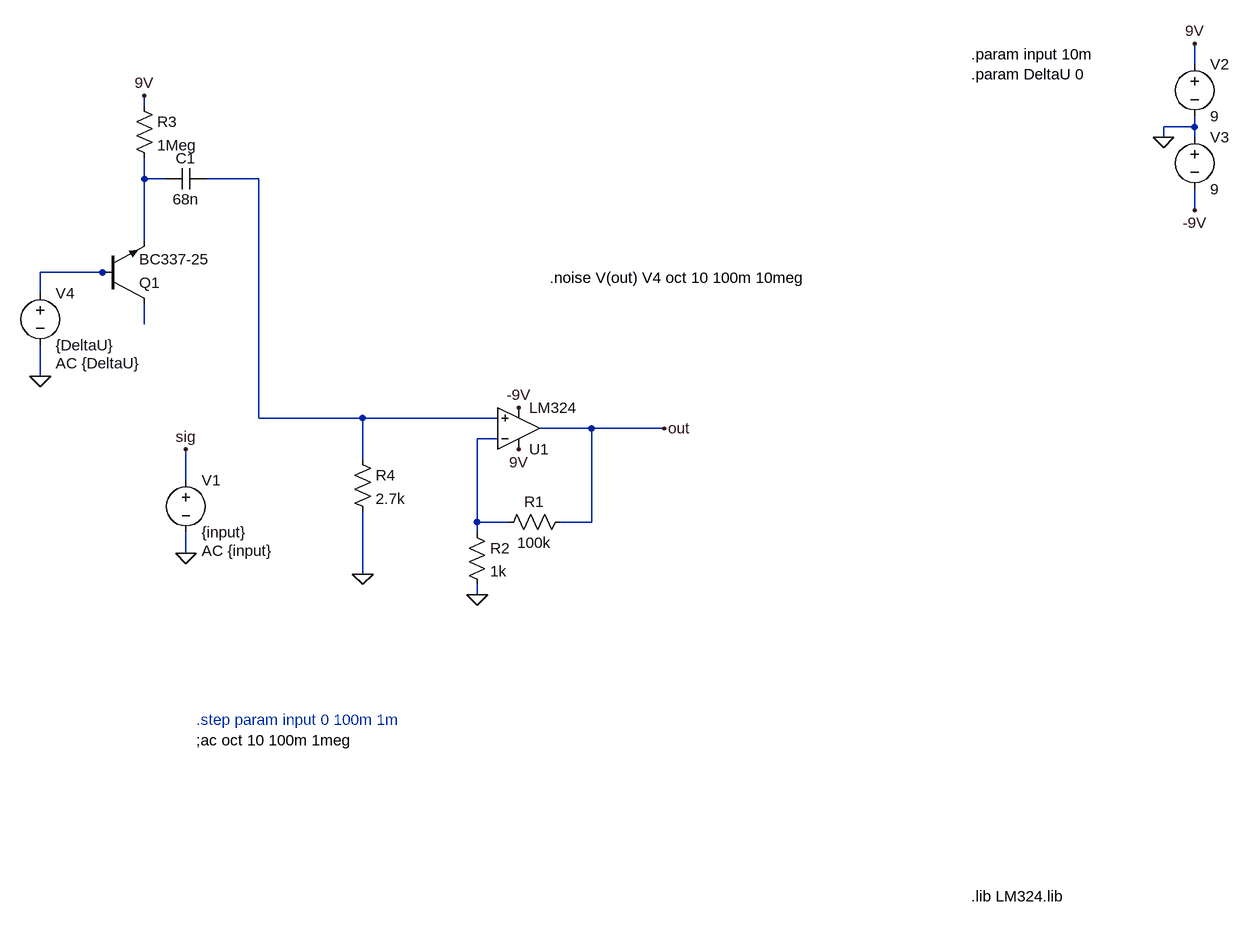
[diagram p0: schematic MessverstaerkerLab10_Shrotrauschen.asc]
MessverstaerkerLab10_Shrotrauschen.asc, the LTspice schematic file:
Version 4
SHEET 1 2032 772
WIRE 1504 -544 1504 -576
WIRE -112 -480 -112 -496
WIRE 1504 -448 1504 -464
WIRE 1504 -448 1456 -448
WIRE 1456 -432 1456 -448
WIRE 1504 -432 1504 -448
WIRE -112 -368 -112 -400
WIRE -80 -368 -112 -368
WIRE 64 -368 -16 -368
WIRE 1504 -320 1504 -352
WIRE -112 -272 -112 -368
WIRE -176 -224 -272 -224
WIRE -160 -224 -176 -224
WIRE -272 -192 -272 -224
WIRE -112 -144 -112 -176
WIRE -272 -64 -272 -112
WIRE 64 0 64 -368
WIRE 224 0 64 0
WIRE 432 0 224 0
WIRE 576 16 496 16
WIRE 688 16 576 16
WIRE 432 32 400 32
WIRE 224 64 224 0
WIRE -48 96 -48 48
WIRE 400 160 400 32
WIRE 448 160 400 160
WIRE 576 160 576 16
WIRE 576 160 528 160
WIRE 400 176 400 160
WIRE -48 208 -48 176
WIRE 224 240 224 144
WIRE 400 272 400 256
FLAG 1456 -432 0
FLAG 1504 -320 -9V
FLAG 1504 -576 9V
FLAG -48 208 0
FLAG -48 48 sig
FLAG 400 272 0
FLAG 688 16 out
FLAG 464 48 9V
FLAG 464 -16 -9V
FLAG -272 -64 0
FLAG -112 -496 9V
FLAG 224 240 0
SYMBOL voltage -48 80 R0
WINDOW 123 24 124 Left 2
WINDOW 39 24 124 Left 2
SYMATTR Value2 AC {input}
SYMATTR InstName V1
SYMATTR Value {input}
SYMBOL voltage 1504 -560 R0
WINDOW 123 0 0 Left 0
WINDOW 39 0 0 Left 0
SYMATTR InstName V2
SYMATTR Value 9
SYMBOL voltage 1504 -448 R0
WINDOW 123 0 0 Left 0
WINDOW 39 0 0 Left 0
SYMATTR InstName V3
SYMATTR Value 9
SYMBOL OpAmps\\opamp2 464 80 M180
SYMATTR InstName U1
SYMATTR Value LM324
SYMBOL res 544 144 R90
WINDOW 0 0 56 VBottom 2
WINDOW 3 32 56 VTop 2
SYMATTR InstName R1
SYMATTR Value 100k
SYMBOL res 384 160 R0
SYMATTR InstName R2
SYMATTR Value 1k
SYMBOL voltage -272 -208 R0
WINDOW 123 24 124 Left 2
WINDOW 39 0 0 Left 0
SYMATTR Value2 AC {DeltaU}
SYMATTR InstName V4
SYMATTR Value {DeltaU}
SYMBOL cap -16 -384 R90
WINDOW 0 0 32 VBottom 2
WINDOW 3 32 32 VTop 2
SYMATTR InstName C1
SYMATTR Value 68n
SYMBOL res -128 -496 R0
SYMATTR InstName R3
SYMATTR Value 1Meg
SYMBOL res 208 48 R0
SYMATTR InstName R4
SYMATTR Value 2.7k
SYMBOL npn -176 -176 M180
SYMATTR InstName Q1
SYMATTR Value BC337-25
TEXT 1160 736 Left 2 !.lib LM324.lib
TEXT -32 496 Left 2 !;ac oct 10 100m 1meg
TEXT -32 464 Left 2 ;.step param input 0 100m 1m
TEXT 1160 -560 Left 2 !.param input 10m\n.param DeltaU 0
TEXT 512 -216 Left 2 !.noise V(out) V4 oct 10 100m 10meg

The netlist it stands for:
* MessverstaerkerLab10_Shrotrauschen.asc
V1 sig 0 {input} AC {input}
V2 9V 0 9
V3 0 -9V 9
XU1 N002 N005 9V -9V out LM324  ; pins In+ In- V+ V- OUT
R1 out N005 100k
R2 N005 0 1k
V4 N003 0 {DeltaU} AC {DeltaU}
C1 N002 N001 68n
R3 9V N001 1Meg
R4 N002 0 2.7k
Q1 N004 N003 N001 0 BC337-25
.model NPN NPN
.model PNP PNP
.lib standard.bjt
.lib LM324.lib
;ac oct 10 100m 1meg
* .step param input 0 100m 1m
.param input 10m
.param DeltaU 0
.noise V(out) V4 oct 10 100m 10meg
.backanno
.end